# EAGLE design NU-Smarticles_old (EAGLE 9.3.0)

## Sheet 1 of 5
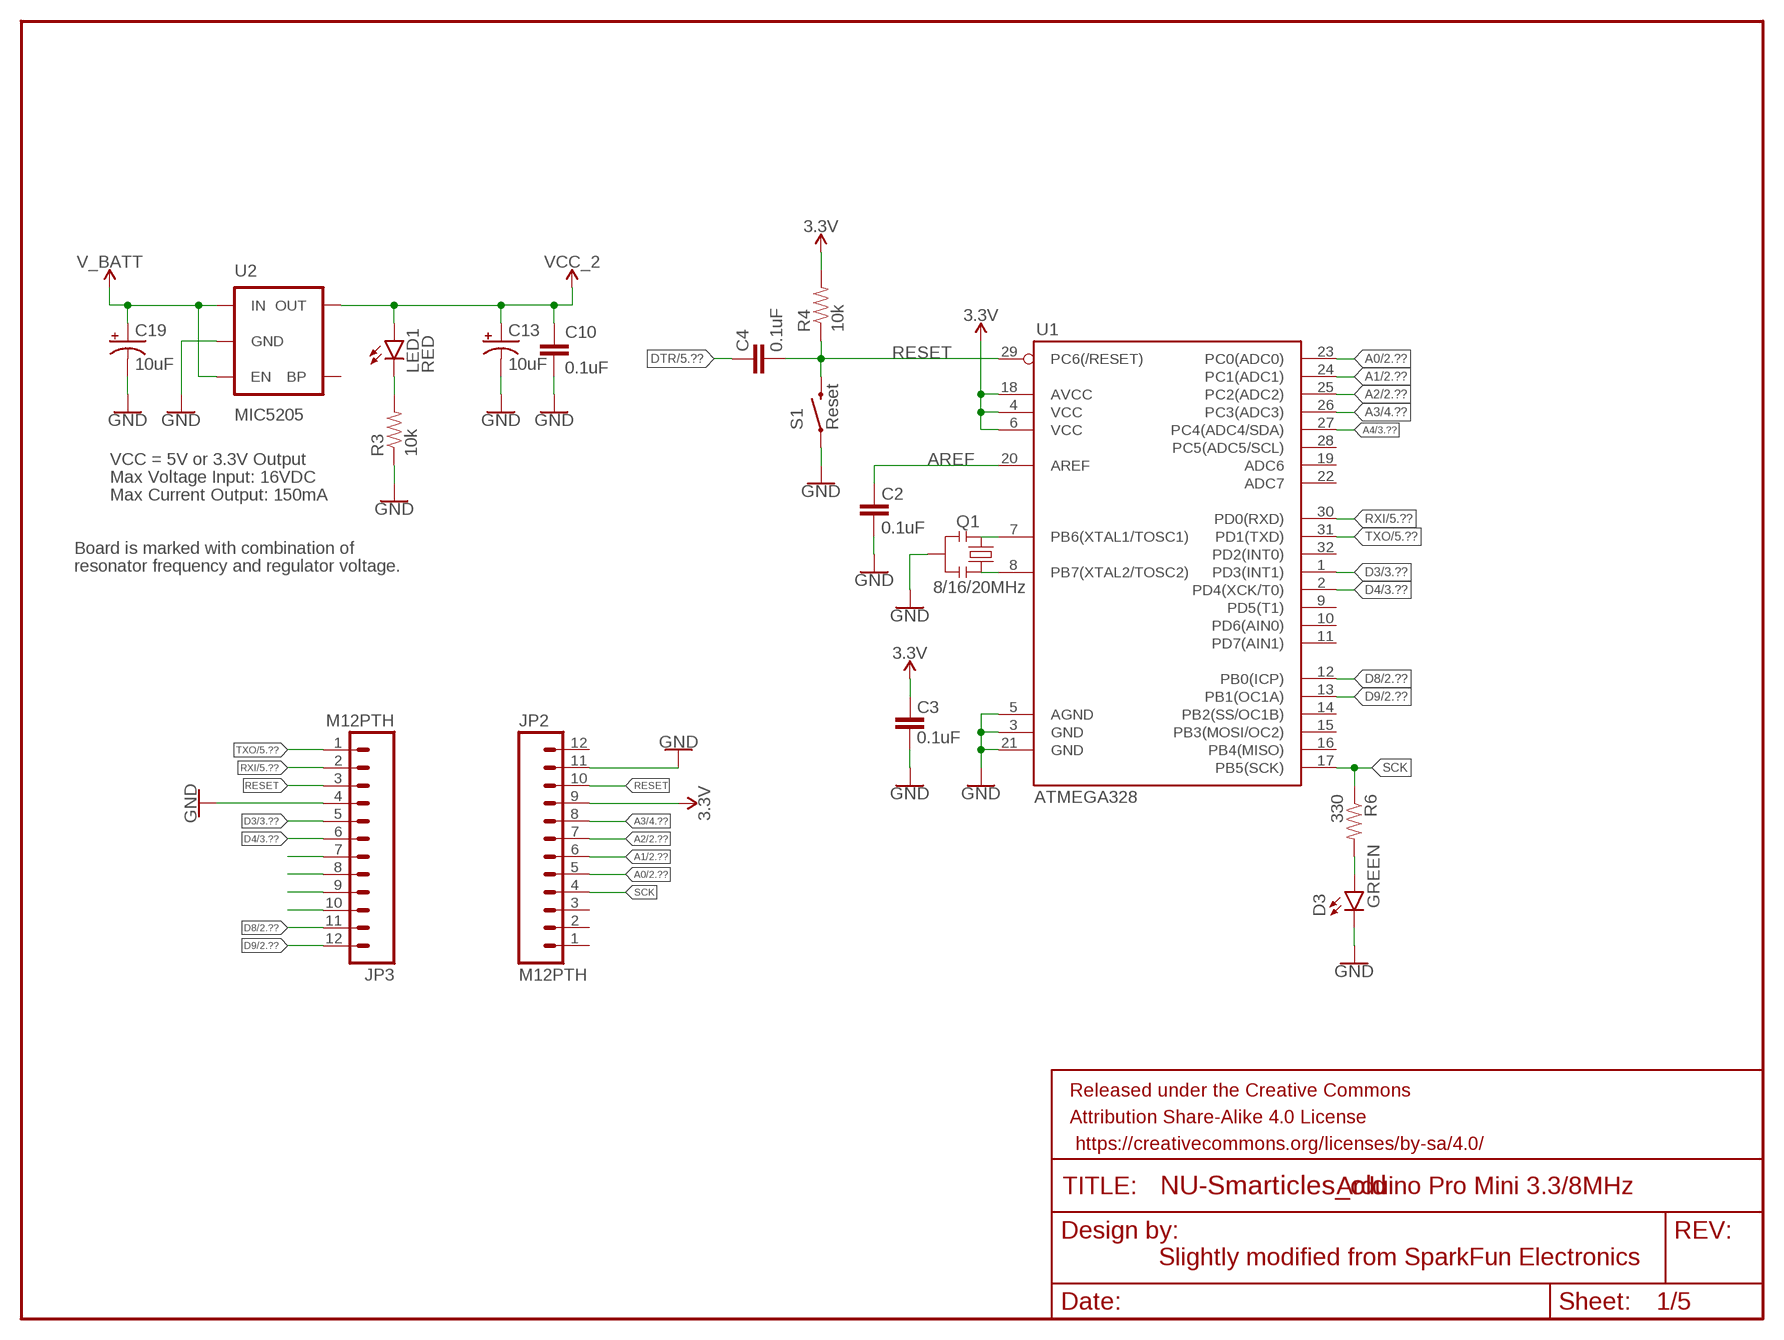
[diagram p0: schematic, sheet 1]

### Parts
C2  0.1uF  0.1UF-0603-25V-(+80/-20%)  [0603]
C3  0.1uF  0.1UF-0603-25V-(+80/-20%)  [0603]
C4  0.1uF  0.1UF-0603-25V-(+80/-20%)  [0603]
C10  0.1uF  0.1UF-0603-25V-(+80/-20%)  [0603]
C13  10uF  10UF-POLAR-0603-6.3V-20%(TANT)  [0603-POLAR]
C19  10uF  10UF-POLAR-0603-6.3V-20%(TANT)  [0603-POLAR]
D3  GREEN  LED-GREEN0603  [LED-0603]
FRAME3  FRAME-LETTER  [CREATIVE_COMMONS]
JP2  M12PTH  [SPARKFUN_1X12]
JP3  M12PTH  [SPARKFUN_1X12]
LED1  RED  LED-RED0603  [LED-0603]
Q1  8/16/20MHz  TESTING_RESONATOR1:1  [TESTING_RESONATOR-SMD-1:1]
R3  10k  10KOHM-0603-1/10W-1%  [0603]
R4  10k  10KOHM-0603-1/10W-1%  [0603]
R6  330  330OHM-0603-1/10W-1%  [0603]
S1  Reset  TESTING_SWITCH-MOMENTARY-2SMD-ALT01  [TESTING_TACTILE-SWITCH-SMD-ALT01]
U1  ATMEGA328  ATMEGA168  [TQFP32-08]
U2  MIC5205  V_REG_LDO  [SOT23-5]

### Nets
3.3V: C3.2 JP2.9 R4.2 U1.4(VCC) U1.6(VCC) U1.18(AVCC) ; also sheet 2,3,4,5
A0: JP2.5 U1.23(PC0(ADC0)) ; also sheet 2
A1: JP2.6 U1.24(PC1(ADC1)) ; also sheet 2
A2: JP2.7 U1.25(PC2(ADC2)) ; also sheet 2
A3: JP2.8 U1.26(PC3(ADC3)) ; also sheet 4
A4: U1.27(PC4(ADC4/SDA)) ; also sheet 3
AREF: C2.2 U1.20(AREF)
D3: JP3.5 U1.1(PD3(INT1)) ; also sheet 3
D4: JP3.6 U1.2(PD4(XCK/T0)) ; also sheet 3
D8: JP3.11 U1.12(PB0(ICP)) ; also sheet 2
D9: JP3.12 U1.13(PB1(OC1A)) ; also sheet 2
DTR: C4.2 ; also sheet 5
GND: C2.1 C3.1 C10.2 C13.- C19.- D3.C JP2.11 JP3.4 Q1.2 R3.1 S1.1 S1.2 U1.3(GND) U1.5(AGND) U1.21(GND) U2.2(GND) ; also sheet 2,3,4,5
N$2: Q1.3 U1.8(PB7(XTAL2/TOSC2))
N$3: Q1.1 U1.7(PB6(XTAL1/TOSC1))
N$6: LED1.C R3.2
N$7: D3.A R6.2
N$36: JP3.7
N$37: JP3.8
N$38: JP3.9
N$39: JP3.10
RESET: C4.1 JP2.10 JP3.3 R4.1 S1.3 S1.4 U1.29(PC6(/RESET))
RXI: JP3.2 U1.30(PD0(RXD)) ; also sheet 5
SCK: JP2.4 R6.1 U1.17(PB5(SCK))
TXO: JP3.1 U1.31(PD1(TXD)) ; also sheet 5
V_BATT: C19.+ U2.1(IN) U2.3(EN) ; also sheet 2,3
VCC_2: C10.1 C13.+ LED1.A U2.5(OUT)
Unconnected: JP2.1 JP2.2 JP2.3 JP2.12 U1.9(PD5(T1)) U1.10(PD6(AIN0)) U1.11(PD7(AIN1)) U1.14(PB2(SS/OC1B)) U1.15(PB3(MOSI/OC2)) U1.16(PB4(MISO)) U1.19(ADC6) U1.22(ADC7) U1.28(PC5(ADC5/SCL)) U1.32(PD2(INT0)) U2.4(BP)

### Notes on the sheet
- VCC = 5V or 3.3V Output
- Max Voltage Input: 16VDC
- Max Current Output: 150mA
- Board is marked with combination of
- resonator frequency and regulator voltage.
- Arduino Pro Mini 3.3/8MHz
- Slightly modified from SparkFun Electronics

## Sheet 2 of 5
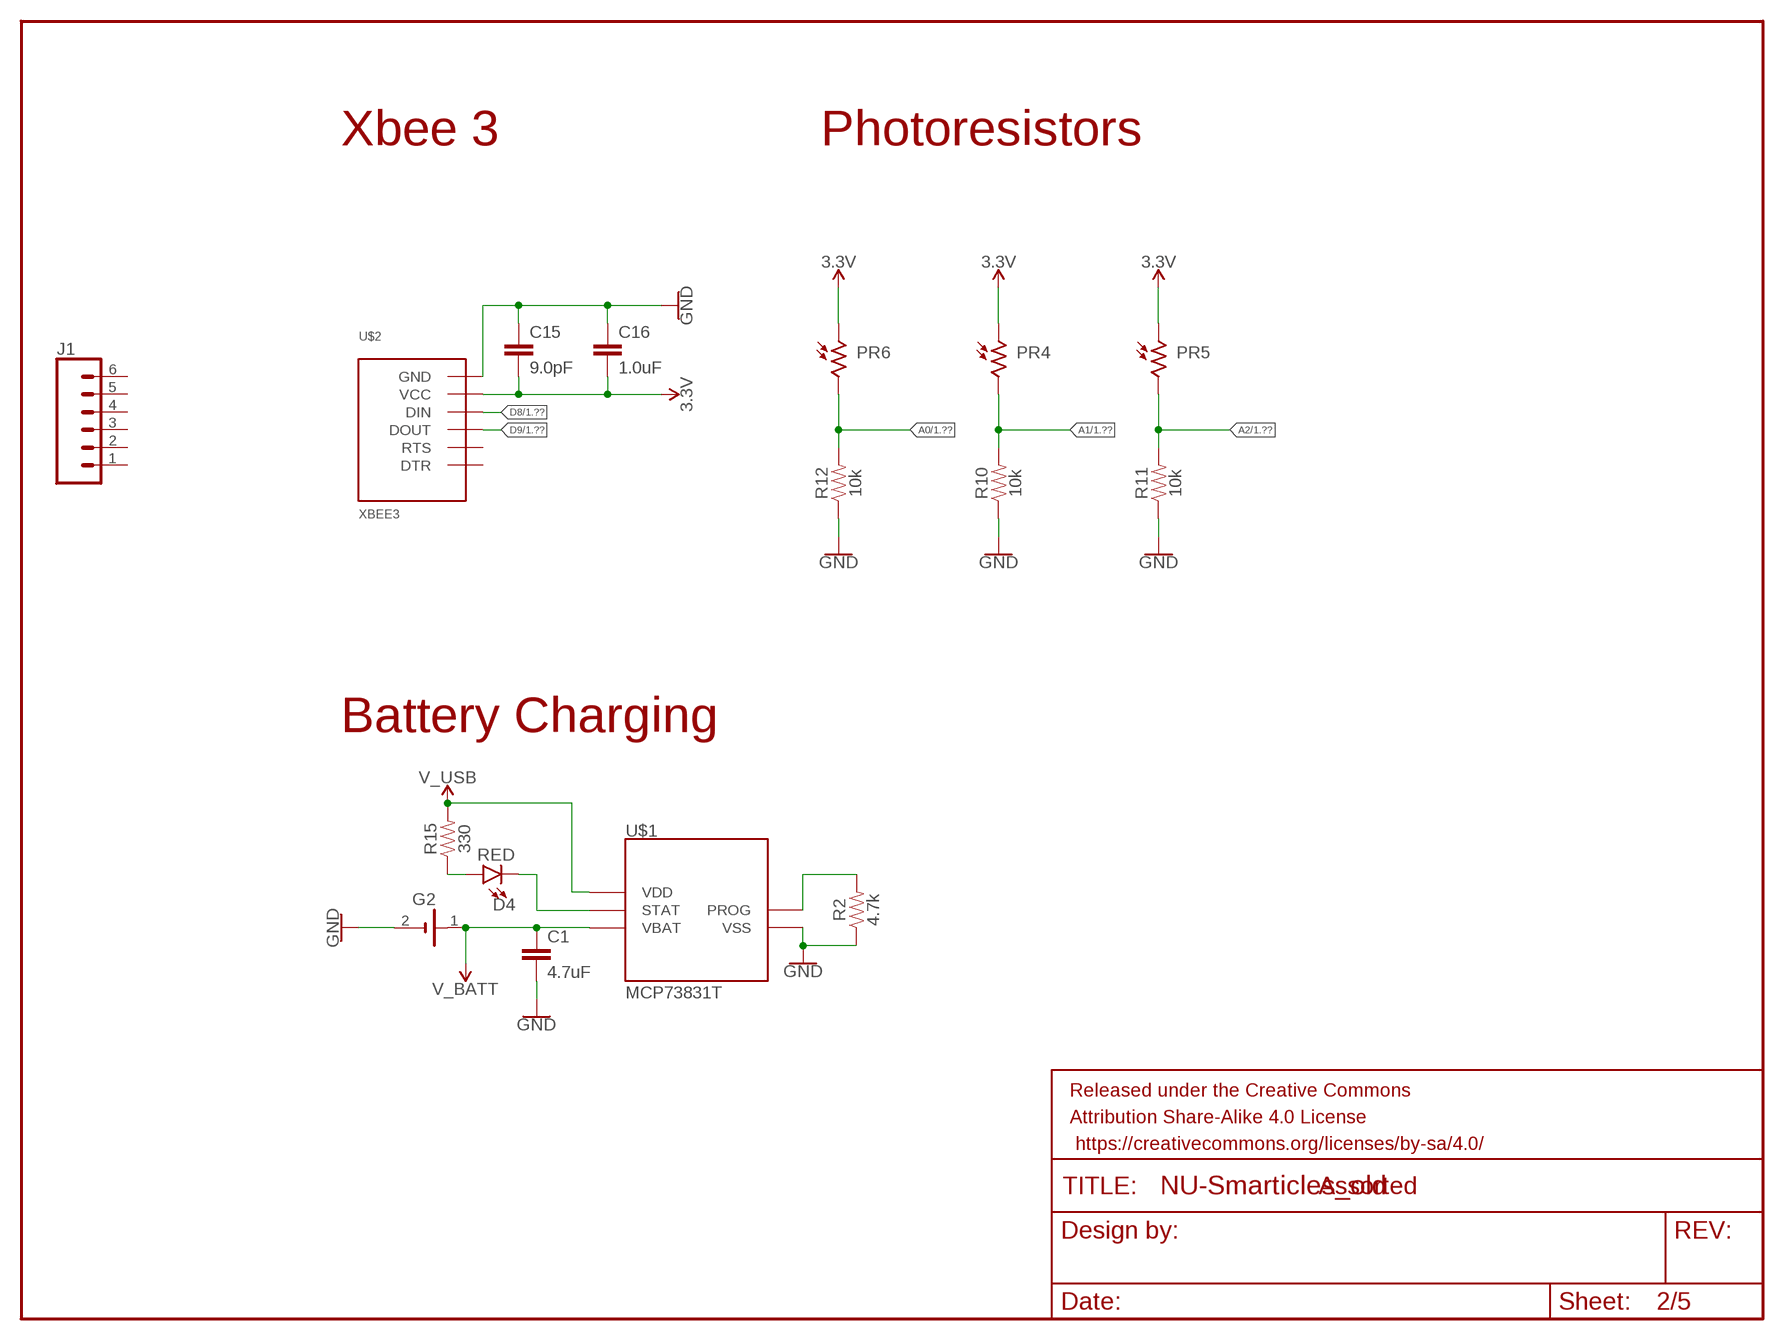
[diagram p1: schematic, sheet 2]

### Parts
C1  4.7uF  4.7UF0603  [0603]
C15  9.0pF  9.0PF-0603-50V-10%  [0603]
C16  1.0uF  1.0UF-0603-16V-10%  [0603]
D4  RED  LED-RED0603  [LED-0603]
FRAME1  FRAME-LETTER  [CREATIVE_COMMONS]
G2  LI-PO  [1X02_BATT]
J1  CONN_06NO_SILK_FEMALE_PTH  [1X06_NO_SILK]
PR4  A1050_09  [T0-46-A10XX]
PR5  A1050_09  [T0-46-A10XX]
PR6  A1050_09  [T0-46-A10XX]
R2  4.7k  4.7KOHM-0603-1/10W-1%  [0603]
R10  10k  10KOHM-0603-1/10W-1%  [0603]
R11  10k  10KOHM-0603-1/10W-1%  [0603]
R12  10k  10KOHM-0603-1/10W-1%  [0603]
R15  330  330OHM-0603-1/10W-1%  [0603]
U$1  MCP73831T  [SOT23-5]
U$2  XBEE3  [XBEE3_MICRO]

### Nets
3.3V: C15.2 C16.2 PR4.1 PR5.1 PR6.1 U$2.VCC ; also sheet 1,3,4,5
A0: PR6.2 R12.2 ; also sheet 1
A1: PR4.2 R10.2 ; also sheet 1
A2: PR5.2 R11.2 ; also sheet 1
D8: U$2.DIN/CONFIG/DIO14(DIN) ; also sheet 1
D9: U$2.DOUT/DIO13(DOUT) ; also sheet 1
GND: C1.2 C15.1 C16.1 G2.2(-) R2.1 R10.1 R11.1 R12.1 U$1.2(VSS) U$2.GND1(GND) ; also sheet 1,3,4,5
N$1: R2.2 U$1.5(PROG)
N$16: D4.A R15.1
N$17: D4.C U$1.1(STAT)
V_BATT: C1.1 G2.1(+) U$1.3(VBAT) ; also sheet 1,3
V_USB: R15.2 U$1.4(VDD) ; also sheet 5
Unconnected: J1.1 J1.2 J1.3 J1.4 J1.5 J1.6 U$2.DTR/SLEEP_RQ/DIO8(DTR) U$2.RTS/DIO6(RTS)

### Notes on the sheet
- Xbee 3 | Photoresistors
- Battery Charging
- Assorted

## Sheet 3 of 5
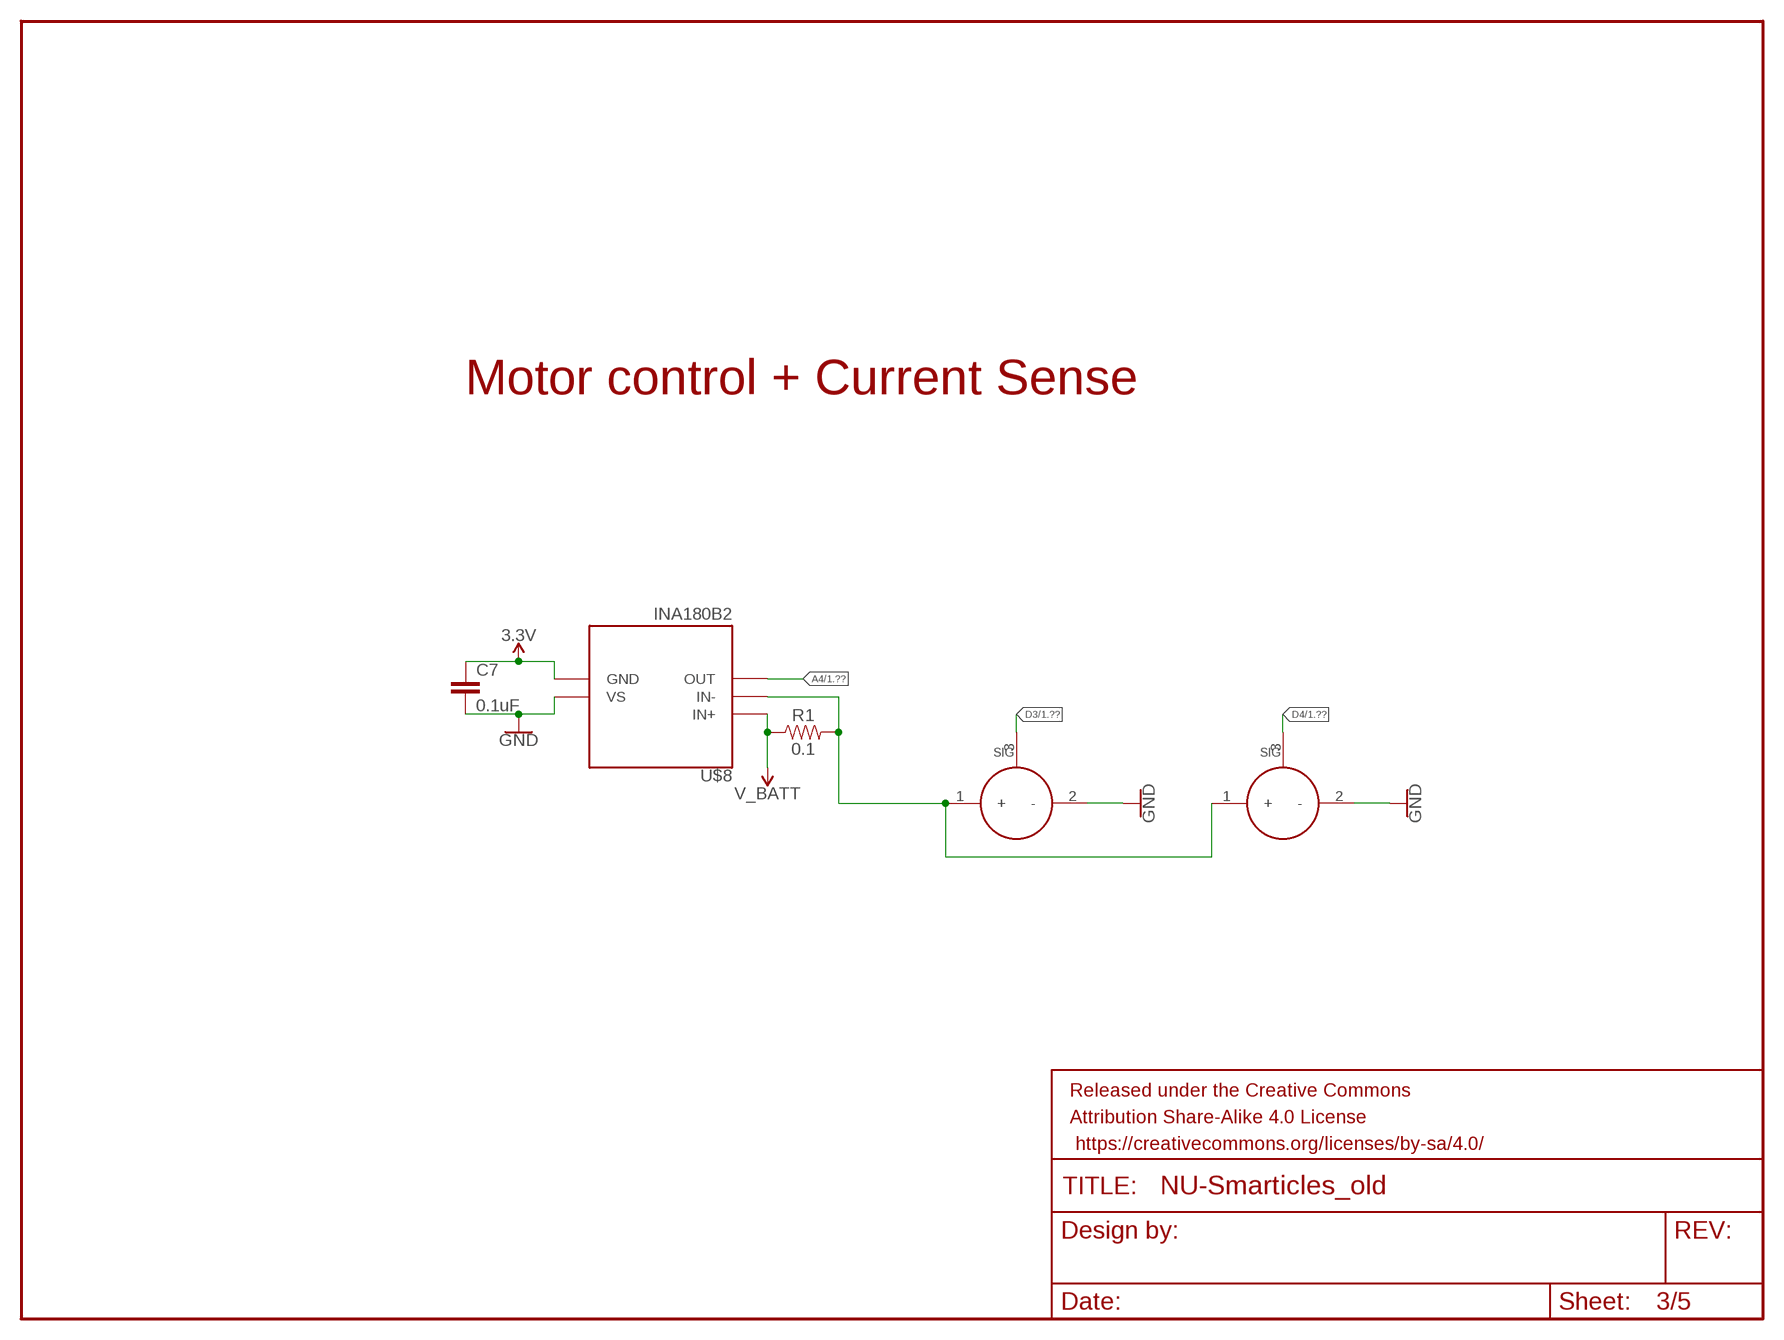
[diagram p2: schematic, sheet 3]

### Parts
C7  0.1uF  0.1UF-0603-25V-5%  [0603]
FRAME2  FRAME-LETTER  [CREATIVE_COMMONS]
R1  0.1  0.1OHM-1210-1/2W-1%  [1210]
U$3  SERVO  [1X03_SERVO]
U$7  SERVO  [1X03_SERVO]
U$8  INA180B2  [SOT23-5]

### Nets
3.3V: C7.1 U$8.2(GND) ; also sheet 1,2,4,5
A4: U$8.4(OUT) ; also sheet 1
D3: U$3.3(SIG) ; also sheet 1
D4: U$7.3(SIG) ; also sheet 1
GND: C7.2 U$3.2(-) U$7.2(-) U$8.5(VS) ; also sheet 1,2,4,5
N$4: R1.2 U$3.1(+) U$7.1(+) U$8.3(IN-)
V_BATT: R1.1 U$8.1(IN+) ; also sheet 1,2

### Notes on the sheet
- Motor control + Current Sense

## Sheet 4 of 5
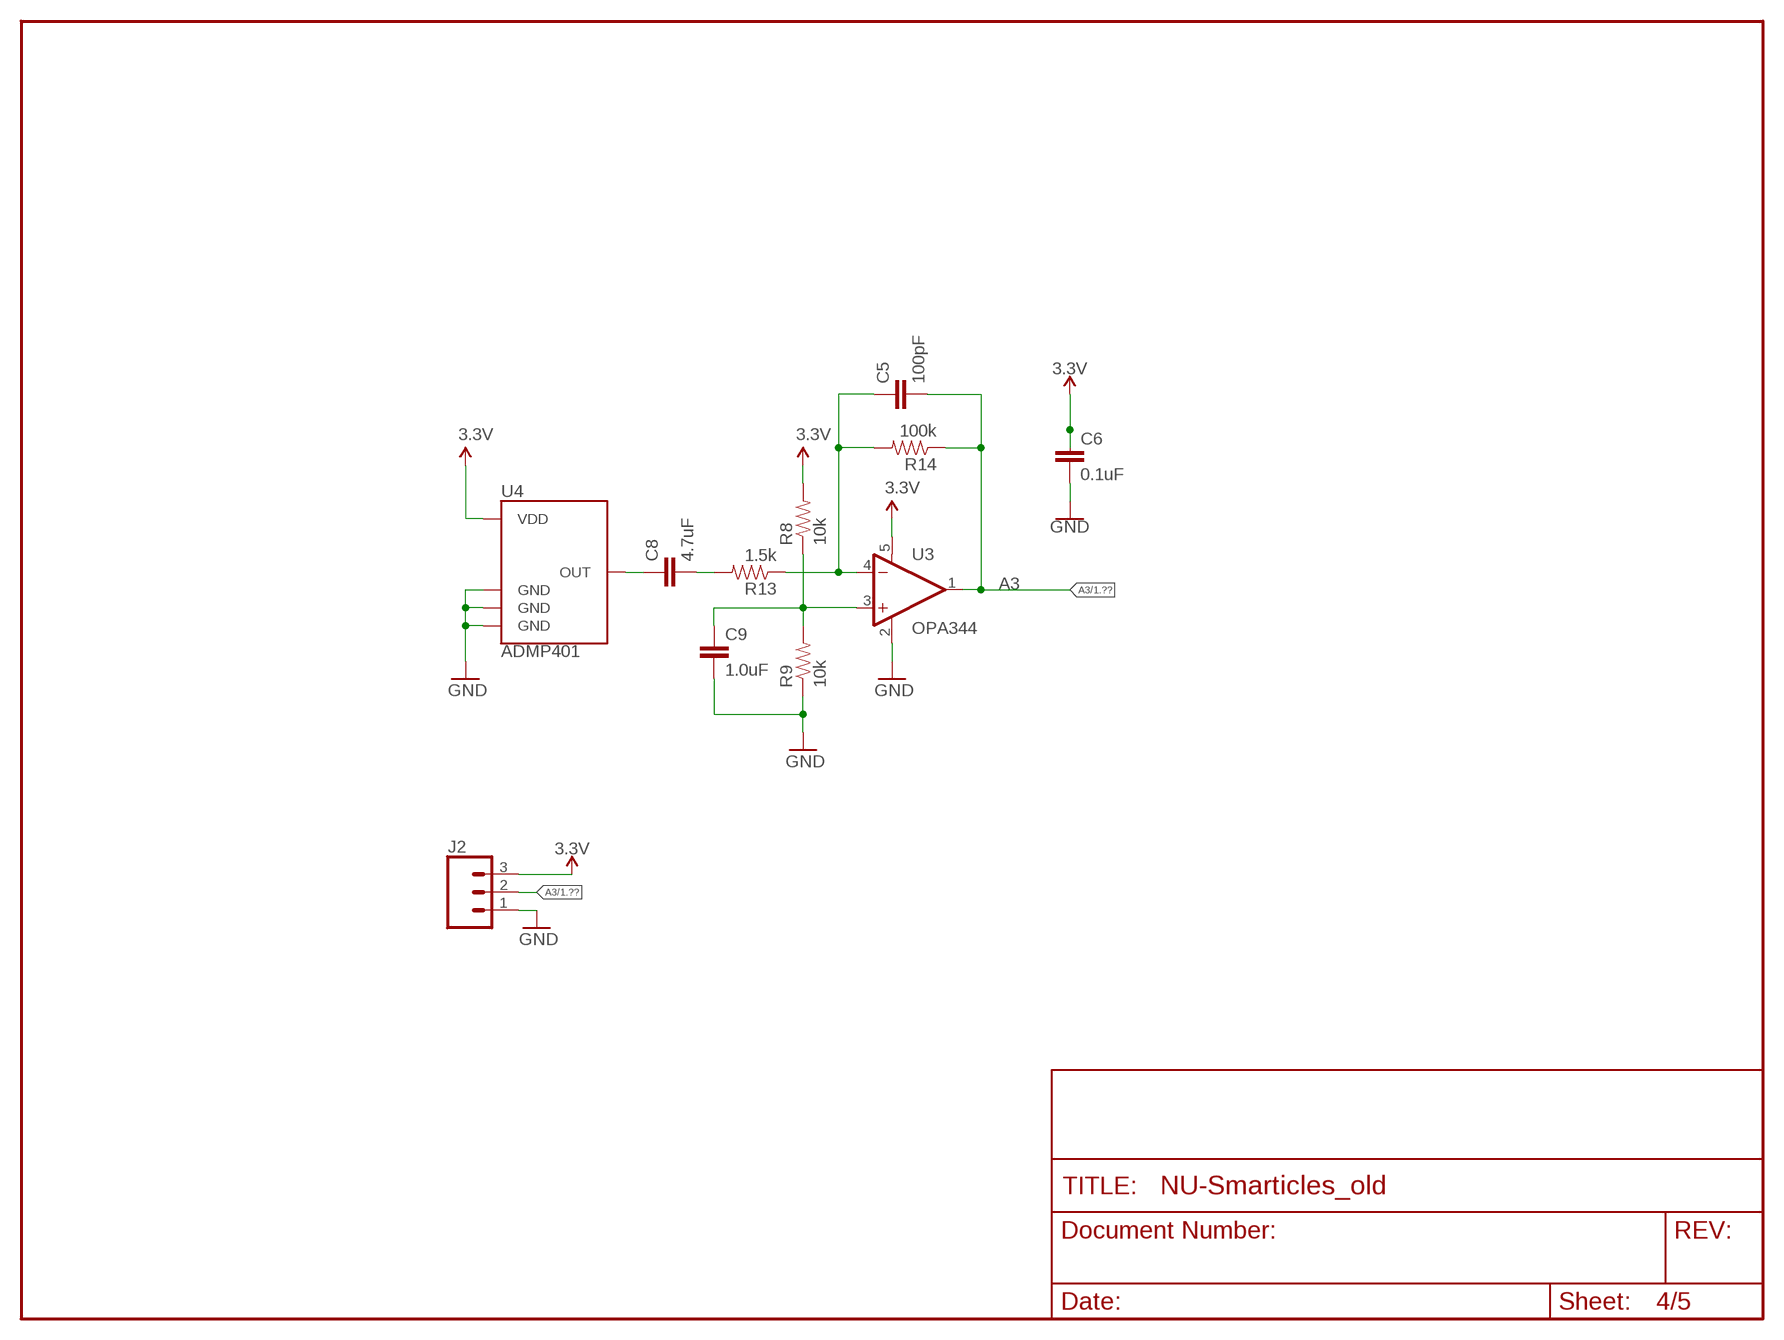
[diagram p3: schematic, sheet 4]

### Parts
C5  100pF  100PF-0603-50V-5%  [0603]
C6  0.1uF  0.1UF-0603-25V-5%  [0603]
C8  4.7uF  4.7UF0603  [0603]
C9  1.0uF  1.0UF-0603-16V-10%  [0603]
J2  CONN_03  [1X03]
R8  10k  10KOHM-0603-1/10W-1%  [0603]
R9  10k  10KOHM-0603-1/10W-1%  [0603]
R13  1.5k  1.5KOHM-0603-1/10W-1%  [0603]
R14  100k  100KOHM-0603-1/10W-1%  [0603]
U3  OPA344  [SOT23-5]
U4  ADMP401  [ADMP401]

### Nets
3.3V: C6.1 J2.3 R8.2 U3.5(V+) U4.5(VDD) ; also sheet 1,2,3,5
A3: C5.2 J2.2 R14.1 U3.1(OUT) ; also sheet 1
GND: C6.2 C9.2 J2.1 R9.1 U3.2(V-) U4.2(GND) U4.4(GND) U4.6(GND) ; also sheet 1,2,3,5
N$8: C8.1 U4.1(OUT)
N$9: C5.1 R13.1 R14.2 U3.4(-IN)
N$10: C8.2 R13.2
N$11: C9.1 R8.1 R9.2 U3.3(+IN)

## Sheet 5 of 5
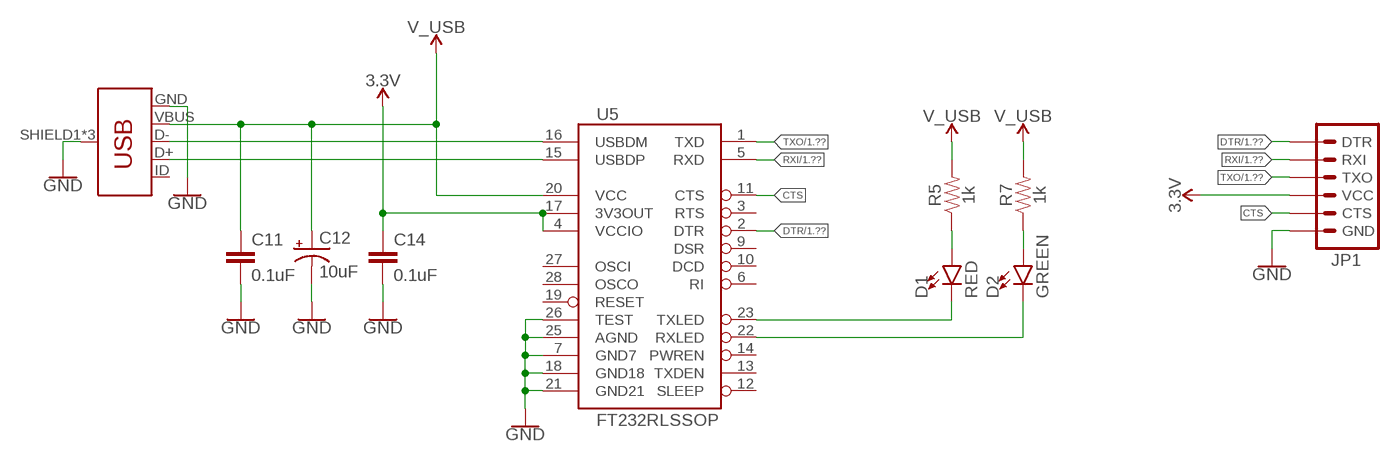
[diagram p4: schematic, sheet 5]

### Parts
C11  0.1uF  0.1UF-0603-25V-(+80/-20%)  [0603]
C12  10uF  10UF-POLAR-0603-6.3V-20%(TANT)  [0603-POLAR]
C14  0.1uF  0.1UF-0603-25V-(+80/-20%)  [0603]
D1  RED  LED-RED0603  [LED-0603]
D2  GREEN  LED-GREEN0603  [LED-0603]
JP1  ARDUINO_SERIAL_PROGRAMPTH  [1X06]
R5  1k  1KOHM-0603-1/10W-1%  [0603]
R7  1k  1KOHM-0603-1/10W-1%  [0603]
U5  FT232RLSSOP  [SSOP28DB]
X2  USB_MICRO-B_FEMALE-SMT  [USB-B-MICRO-SMD]

### Nets
3.3V: C14.1 JP1.4(VCC) U5.4(VCCIO) U5.17(3V3OUT) ; also sheet 1,2,3,4
CTS: JP1.5(CTS) U5.11(CTS)
DTR: JP1.1(DTR) U5.2(DTR) ; also sheet 1
GND: C11.2 C12.- C14.2 JP1.6(GND) U5.7(GND7) U5.18(GND18) U5.21(GND21) U5.25(AGND) U5.26(TEST) X2.GND X2.SHIELD1(SHIELD) X2.SHIELD2(SHIELD) X2.SHIELD3(SHIELD) ; also sheet 1,2,3,4
N$12: D1.A R5.1
N$13: D2.A R7.1
RXI: JP1.2(RXI) U5.5(RXD) ; also sheet 1
RXLED: D2.C U5.22(RXLED)
TXLED: D1.C U5.23(TXLED)
TXO: JP1.3(TXO) U5.1(TXD) ; also sheet 1
USB_D+: U5.15(USBDP) X2.D+
USB_D-: U5.16(USBDM) X2.D-
V_USB: C11.1 C12.+ R5.2 R7.2 U5.20(VCC) X2.VBUS ; also sheet 2
Unconnected: U5.3(RTS) U5.6(RI) U5.9(DSR) U5.10(DCD) U5.12(SLEEP) U5.13(TXDEN) U5.14(PWREN) U5.19(RESET) U5.27(OSCI) U5.28(OSCO)

## Power pins joined to a net without a drawn wire
ID: X2.ID

## Library data of the parts
C1 C8 = SparkFun-Capacitors:4.7UF: 4.7µF ceramic capacitors A capacitor is a passive two-terminal electrical component used to store electrical energy temporarily in an electric field.; PROD_ID: CAP-08280
C2-C4 C10 C11 C14 = SparkFun-Capacitors:0.1UF: 0.1µF ceramic capacitors A capacitor is a passive two-terminal electrical component used to store electrical energy temporarily in an electric field.; PROD_ID: CAP-00810
C5 = SparkFun-Capacitors:100PF: 100pF/0.1nF ceramic capacitors A capacitor is a passive two-terminal electrical component used to store electrical energy temporarily in an electric field.; PROD_ID: CAP-07883
C6 C7 = SparkFun-Capacitors:0.1UF: 0.1µF ceramic capacitors A capacitor is a passive two-terminal electrical component used to store electrical energy temporarily in an electric field.; PROD_ID: CAP-08604
C9 C16 = SparkFun-Capacitors:1.0UF: 1µF ceramic capacitors A capacitor is a passive two-terminal electrical component used to store electrical energy temporarily in an electric field.; PROD_ID: CAP-00868
C12 C13 C19 = SparkFun-Capacitors:10UF-POLAR: 10.0µF polarized capacitors A capacitor is a passive two-terminal electrical component used to store electrical energy temporarily in an electric field.; PROD_ID: CAP-13210
C15 = SparkFun-Capacitors:9.0PF: 9.0pF ceramic capacitors A capacitor is a passive two-terminal electrical component used to store electrical energy temporarily in an electric field.; PROD_ID: CAP-09341
D1 D4 LED1 = SparkFun-LED:LED-RED: Red SMD LED Used in manufacturing of most products at SparkFun Packages: 0603 - SMD 0603 package [Product Link] <http://docs.avagotech.com/docs/AV02-0551EN> 0603 SMART - SMD 0603 SMART package ( more efficient and expensive)[Product Link] <http://www.osram-os.com/Graphics/XPic2/00077099_0.pdf> 1206 - SMD1206 package [Product Link] <https://www.sparkfun.com/datasheets/DevTools/LilyPad/Q150OVS4.pdff> SparkFun Products: Pro Mini 328 -5V <https://www.sparkfun.com/products/821> RedBoard <https://www.sparkfun.com/products/12757> IOIO-OTG <https://www.sparkfun.com/products/13613>; PROD_ID: DIO-00819
D2 D3 = SparkFun-LED:LED-GREEN: Green SMD LED Used in manufacturing of various products at SparkFun Packages: 0603 - SMD 0603 package [Product Link] <http://www.futureelectronics.com/en/technologies/semiconductors/optoelectronics/leds/Pages/9894312-LTST-C190GKT.aspx?CrossPart=HSMG-C190&IM=0> LilyPad 1206 - SMD1206 LilyPad package [Product Link] <http://www.futureelectronics.com/en/Technologies/Product.aspx?ProductID=IN150NGHARVATEKCORPORATION2049943&IM=0> 1206 - SMD1206 package [Product Link] <http://www.futureelectronics.com/en/technologies/semiconductors/optoelectronics/leds/Pages/8315665-LTST-C150KGKT.aspx?IM=0> 1206 Bottom Mount -SMD 1206 Bottom Mount [Product Link] <http://www.digikey.com/product-detail/en/lite-on-inc/LTST-C230KGKT/160-1456-1-ND/386854> SparkFun Products: Pro Mini 328 -5V <https://www.sparkfun.com/products/821> RedBoard <https://www.sparkfun.com/products/12757> MP3 Trigger <https://www.sparkfun.com/products/13720> Makey Makey <https://www.sparkfun.com/products/11076>; PROD_ID: DIO-00821
FRAME1-FRAME3 = SparkFun-Aesthetics:FRAME-LETTER: Schematic Frame - Letter Standard 8.5x11 US Letter frame
G2 = Smarticles:LI-PO
J1 = SparkFun-Connectors:CONN_06: Multi connection point. Often used as Generic Header-pin footprint for 0.1 inch spaced/style header connections On any of the 0.1 inch spaced packages, you can populate with these: Break Away Headers - Straight <https://www.sparkfun.com/products/116> (PRT-00116) Break Away Male Headers - Right Angle <https://www.sparkfun.com/products/553> (PRT-00553) Female Headers <https://www.sparkfun.com/products/115> (PRT-00115) Break Away Headers - Machine Pin <https://www.sparkfun.com/products/117> (PRT-00117) Break Away Female Headers - Swiss Machine Pin <https://www.sparkfun.com/products/743> (PRT-00743) Arduino Stackable Header - 6 Pin <https://www.sparkfun.com/products/9280> (PRT-09280) For SCREWTERMINALS and SPRING TERMINALS visit here: Screw Terimnals on SparkFun.com <https://www.sparkfun.com/search/results?term=Screw+Terminals> (5mm/3.5mm/2.54mm spacing) This device is also useful as a general connection point to wire up your design to another part of your project. Our various solder wires solder well into these plated through hole pads. Hook-Up Wire - Assortment (Stranded, 22 AWG) <https://www.sparkfun.com/products/11375> (PRT-11375) Hook-Up Wire - Assortment (Solid Core, 22 AWG) <https://www.sparkfun.com/products/11367> (PRT-11367) View the entire wire category on our website here <https://www.sparkfun.com/categories/141>; PROD_ID: CONN-08437
J2 = SparkFun-Connectors:CONN_03: Multi connection point. Often used as Generic Header-pin footprint for 0.1 inch spaced/style header connections On any of the 0.1 inch spaced packages, you can populate with these: Break Away Headers - Straight <https://www.sparkfun.com/products/116> (PRT-00116) Break Away Male Headers - Right Angle <https://www.sparkfun.com/products/553> (PRT-00553) Female Headers <https://www.sparkfun.com/products/115> (PRT-00115) Break Away Headers - Machine Pin <https://www.sparkfun.com/products/117> (PRT-00117) Break Away Female Headers - Swiss Machine Pin <https://www.sparkfun.com/products/743> (PRT-00743) Stackable Header - 3 Pin (Female, 0.1") <https://www.sparkfun.com/products/13875> (PRT-13875) For SCREWTERMINALS and SPRING TERMINALS visit here: Screw Terimnals on SparkFun.com <https://www.sparkfun.com/search/results?term=Screw+Terminals> (5mm/3.5mm/2.54mm spacing) This device is also useful as a general connection point to wire up your design to another part of your project. Our various solder wires solder well into these plated through hole pads. Hook-Up Wire - Assortment (Stranded, 22 AWG) <https://www.sparkfun.com/products/11375> (PRT-11375) Hook-Up Wire - Assortment (Solid Core, 22 AWG) <https://www.sparkfun.com/products/11367> (PRT-11367) View the entire wire category on our website here <https://www.sparkfun.com/categories/141> Special notes: Molex polarized connector foot print use with SKU : PRT-08232 with associated crimp pins and housings.
JP1 = NU-Smarticles:ARDUINO_SERIAL_PROGRAM
JP2 JP3 = NU-Smarticles:M12: Header 12 Standard 12-pin 0.1" header. Use with straight break away headers (SKU : PRT-00116), right angle break away headers (PRT-00553), swiss pins (PRT-00743), machine pins (PRT-00117), and female headers (PRT-00115).
PR4-PR6 = photo-elements:A10: Sensor Robust Light Sensing Applications Outdoor Light Sensing Application Source: http://optoelectronics.perkinelmer.com/content/Datasheets/DTS_PhotocellsA1050.pdf
Q1 = NU-Smarticles:TESTING_RESONATOR: Resonator Small SMD resonator. This is the itty bitty 10/20MHz resonators with built in caps. CSTCE10M0G55 and CSTCE20M0V53. Footprint for SMD has been used in SFE production for years, and does work okay. 1:1 is an attempt to get larger fillets on the sides so it will be easier to inspect these solders in our AOI machine. The pads have been minimized to match the actual metal under the resonator. To see this relation, it includes an image import of the bottom side of the component. Imported to scale on layer 200.
R1 = SparkFun-Resistors:0.1OHM: 0.1Ω resistor A resistor is a passive two-terminal electrical component that implements electrical resistance as a circuit element. Resistors act to reduce current flow, and, at the same time, act to lower voltage levels within circuits. - Wikipedia; PROD_ID: RES-12374
R2 = SparkFun-Resistors:4.7KOHM: 4.7kΩ resistor A resistor is a passive two-terminal electrical component that implements electrical resistance as a circuit element. Resistors act to reduce current flow, and, at the same time, act to lower voltage levels within circuits. - Wikipedia; PROD_ID: RES-07857
R3 R4 R8-R12 = SparkFun-Resistors:10KOHM: 10kΩ resistor A resistor is a passive two-terminal electrical component that implements electrical resistance as a circuit element. Resistors act to reduce current flow, and, at the same time, act to lower voltage levels within circuits. - Wikipedia; PROD_ID: RES-00824
R5 R7 = SparkFun-Resistors:1KOHM: 1kΩ resistor A resistor is a passive two-terminal electrical component that implements electrical resistance as a circuit element. Resistors act to reduce current flow, and, at the same time, act to lower voltage levels within circuits. - Wikipedia; PROD_ID: RES-07856
R6 R15 = SparkFun-Resistors:330OHM: 330Ω resistor A resistor is a passive two-terminal electrical component that implements electrical resistance as a circuit element. Resistors act to reduce current flow, and, at the same time, act to lower voltage levels within circuits. - Wikipedia; PROD_ID: RES-00818
R13 = SparkFun-Resistors:1.5KOHM: 1.5kΩ resistor A resistor is a passive two-terminal electrical component that implements electrical resistance as a circuit element. Resistors act to reduce current flow, and, at the same time, act to lower voltage levels within circuits. - Wikipedia; PROD_ID: RES-08306
R14 = SparkFun-Resistors:100KOHM: 100kΩ resistor A resistor is a passive two-terminal electrical component that implements electrical resistance as a circuit element. Resistors act to reduce current flow, and, at the same time, act to lower voltage levels within circuits. - Wikipedia; PROD_ID: RES-07828
S1 = NU-Smarticles:TESTING_SWITCH-MOMENTARY-2: Various NO switches- pushbuttons, reed, etc; PROD_ID: SWCH-08247
U1 = NU-Smarticles:ATMEGA168: 8MHz MCU
U2 = NU-Smarticles:V_REG_LDO: Voltage Regulator LDO Standard 150mA LDO voltage regulator in SOT-23 layout. Micrel part MIC5205. BP (by-pass) pin is used to lower output noise with 470pF cap.
U3 = NU-Smarticles:OPA344
U4 = NU-Smarticles:ADMP401: MEMS Microphone
U5 = NU-Smarticles:FT232RL: USB UART FT232RL 4th Generation USB UART (USB <-> Serial) Controller. Spark Fun Electronics SKU : COM-00650
U$1 = NU-Smarticles:MCP73831T: LiPo Battery Charger
U$2 = NU-Smarticles:XBEE3: XBee 3 802.15
U$3 U$7 = NU-Smarticles:SERVO
U$8 = NU-Smarticles:INA180B2: 50x gain current sense amplifier
X2 = NU-Smarticles:USB_MICRO-B: USB Type Micro-B Connector Male/female and PTH/SMT variants SparkFun Products: SparkFun microB USB Breakout <https://www.sparkfun.com/products/12035> SparkFun USB microB Plug Breakout <https://www.sparkfun.com/products/10031> SparkFun ESP8266 Thing <https://www.sparkfun.com/products/13231>; PROD_ID: CONN-11752

## Net classes
1 vcc: width 0.254 mm

## Board
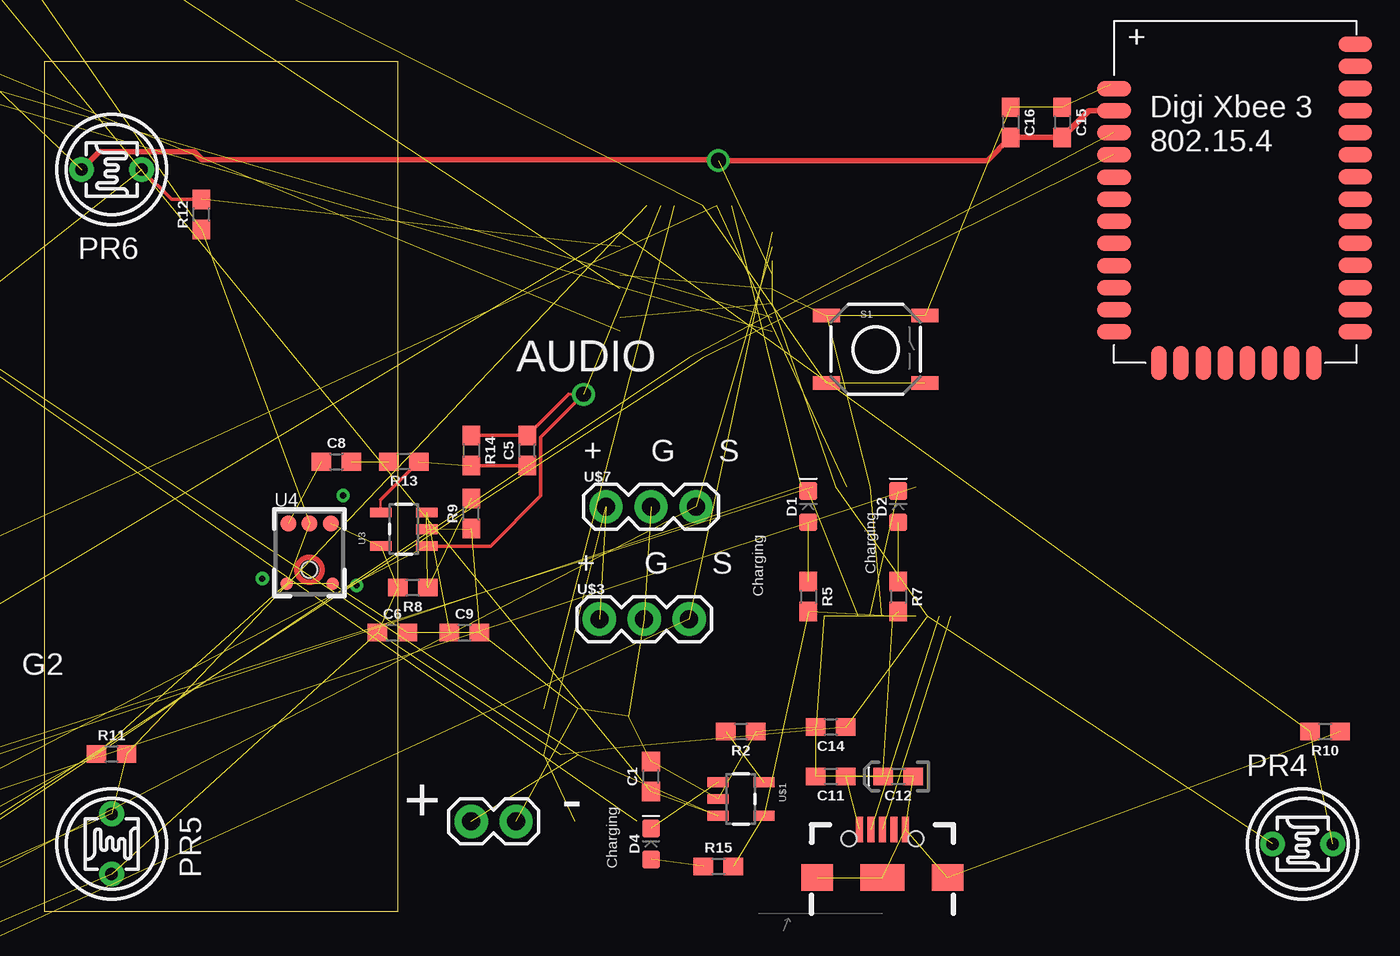
[diagram p5: board, top side]
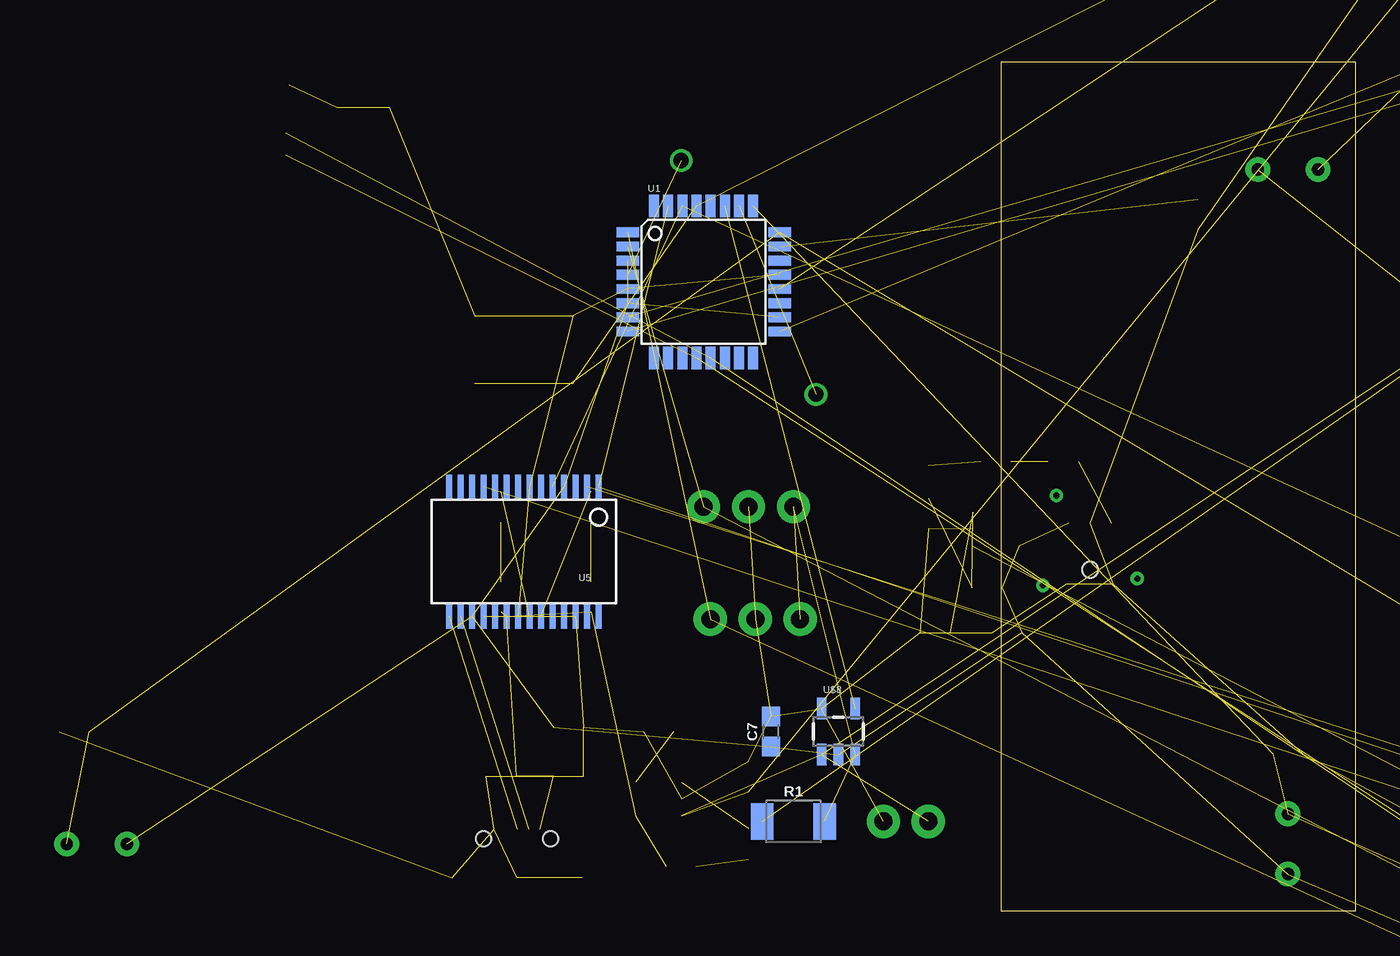
[diagram p6: board, bottom side, seen from below]

Size 20 x 48 mm. Coordinates in mm from the lower left corner, seen from the top.
Outline: 0,0 20,0 20,48 0,48 0,0
Copper layers (1+2*15+16): Top 0.035mm / dielectric 1.5mm / Route2 0.035mm / dielectric 0.15mm / Route15 0.035mm / dielectric 0.2mm / Bottom 0.035mm
Design rules "default *": minimum track width 6mil, minimum drill 0.35mm, track to track 6mil, track to pad 6mil, pad to pad 6mil, via to via 6mil, smd to smd 6mil, copper to edge 40mil, drill to drill 6mil, minimum pad ring 10mil, minimum via ring 8mil, stop-mask expansion 4mil, vias tented up to drill 0mil, thermal gap 10mil

### Footprints (pad centres in the part's own frame; a part is rotated, then mirrored left to right if it is on the bottom)
0603 = smd 1.1 x 1: 1 -0.85,0; 2 0.85,0
0603-POLAR = smd 1.1 x 1: + 0.85,0; - -0.85,0
LED-0603 = smd 1 x 1: A -0.877,0; C 0.877,0
1X02_BATT = drill 1.016 pad 1.88: 1 0,0; 2 2.54,0
1X06_NO_SILK = drill 1.016 pad 1.88: 1 0,0; 2 2.54,0; 3 5.08,0; 4 7.62,0; 5 10.16,0; 6 12.7,0
1X03 = drill 1.016 pad 1.88: 1 0,0; 2 2.54,0; 3 5.08,0
1X06 = drill 1.016 pad 1.88: 1 0,0; 2 2.54,0; 3 5.08,0; 4 7.62,0; 5 10.16,0; 6 12.7,0
SPARKFUN_1X12 = drill 1.016 pad 1.88: 1 0,0; 2 2.54,0; 3 5.08,0; 4 7.62,0; 5 10.16,0; 6 12.7,0; 7 15.24,0; 8 17.78,0; 9 20.32,0; 10 22.86,0; 11 25.4,0; 12 27.94,0
T0-46-A10XX = drill 0.7 pad 1.4: 1 -1.7,0; 2 1.7,0
TESTING_RESONATOR-SMD-1:1 = smd 0.45 x 1.905: 1 -1.2,0; 2 0,0; 3 1.2,0
1210 = smd 1.27 x 2.06: 1 -1.755,0; 2 1.755,0
TESTING_TACTILE-SWITCH-SMD-ALT01 = smd 1.524 x 0.762: 1 -2.794,1.905; 2 2.794,1.905; 3 -2.794,-1.905; 4 2.794,-1.905
TQFP32-08 = smd 1.27 x 0.559: 1 -4.293,2.8; 2 -4.293,2; 3 -4.293,1.2; 4 -4.293,0.4; 5 -4.293,-0.4; 6 -4.293,-1.2; 7 -4.293,-2; 8 -4.293,-2.8; 17 4.293,-2.8; 18 4.293,-2; 19 4.293,-1.2; 20 4.293,-0.4; 21 4.293,0.4; 22 4.293,1.2; 23 4.293,2; 24 4.293,2.8 | smd 0.559 x 1.27: 9 -2.8,-4.293; 10 -2,-4.293; 11 -1.2,-4.293; 12 -0.4,-4.293; 13 0.4,-4.293; 14 1.2,-4.293; 15 2,-4.293; 16 2.8,-4.293; 25 2.8,4.293; 26 2,4.293; 27 1.2,4.293; 28 0.4,4.293; 29 -0.4,4.293; 30 -1.2,4.293; 31 -2,4.293; 32 -2.8,4.293
SOT23-5 = smd 0.55 x 1.2: 1 -0.95,-1.3; 2 0,-1.3; 3 0.95,-1.3; 4 0.95,1.3; 5 -0.95,1.3
ADMP401 = smd 0.9 x 0.9: 1 -1.2,2.62; 5 1.2,2.62; 6 0,2.62 | smd 0.7 x 0.7: 2 1.3,-0.8; 4 -1.3,-0.8 | hole 0.9: 0,0
SSOP28DB = smd 0.348 x 1.397: 1 -4.225,-3.656; 2 -3.575,-3.656; 3 -2.925,-3.656; 4 -2.275,-3.656; 5 -1.625,-3.656; 6 -0.975,-3.656; 7 -0.325,-3.656; 8 0.325,-3.656; 9 0.975,-3.656; 10 1.625,-3.656; 11 2.275,-3.656; 12 2.925,-3.656; 13 3.575,-3.656; 14 4.225,-3.656; 15 4.225,3.656; 16 3.575,3.656; 17 2.925,3.656; 18 2.275,3.656; 19 1.625,3.656; 20 0.975,3.656; 21 0.325,3.656; 22 -0.325,3.656; 23 -0.975,3.656; 24 -1.625,3.656; 25 -2.275,3.656; 26 -2.925,3.656; 27 -3.575,3.656; 28 -4.225,3.656
XBEE3_MICRO = smd 0.864 x 1.905: [RESERVED1] 0.681,-9.652; [RESERVED2] 1.93,-9.652; [RESERVED3] 3.18,-9.652; [RESERVED4] 4.43,-9.652; SPI_CLK/DIO18 -4.318,-9.652; SPI_MOSI/DIO15 -0.569,-9.652; SPI_MOSI/DIO16 -1.819,-9.652; SPI_SSEL/DIO17 -3.068,-9.652 | smd 1.905 x 0.864: [RESERVED5] 6.782,-6.65; AD0/DIO0 6.782,4.597; AD1/DIO1 6.782,3.348; AD2/DIO2 6.782,2.098; AD3/DIO3 6.782,0.848; ASSOCIATE/DIO5 6.782,-1.651; CTS/DIO7 6.782,-4.15; DIN/CONFIG/DIO14 -6.858,2.093; DIO4 6.782,-5.4; DIO12 -6.858,0.843; DOUT/DIO13 -6.858,3.343; DTR/SLEEP_RQ/DIO8 -6.858,-4.155; GND1 -6.858,5.842; GND2 -6.858,-5.405; GND3 -6.858,-7.904; GND4 6.782,-7.899; GND5 6.782,5.847; GND6 6.782,8.346; ON/SLEEP/DIO9 6.782,-2.901; PWM1/DIO11 -6.858,-2.906; RF 6.782,7.097; RSSI_PWM/DIO10 -6.858,-1.656; RST -6.858,-0.406; RTS/DIO6 6.782,-0.401; SPI_ATTN/BOOTMODE/DIO19 -6.858,-6.655; VCC -6.858,4.592
1X03_SERVO = drill 1.016 pad 1.88: 1 0,0; 2 2.54,0; 3 5.08,0
USB-B-MICRO-SMD = smd 1.45 x 0.4: D+ 2.725,0; D- 2.725,0.65; GND 2.725,-1.3; ID 2.725,-0.65; VBUS 2.725,1.3 | smd 1.5 x 1.8: SHIELD1 0,3.685; SHIELD2 0,-3.685 | smd 1.5 x 2.5: SHIELD3 0,0 | hole 0.85: 2.2,1.9; 2.2,-1.9

### Placement (x,y rotation side)
C1  34.29,7.62 90 top  (outside the outline)
C2  -30.48,77.47 0 bottom  (outside the outline)
C3  -34.29,77.47 0 bottom  (outside the outline)
C4  -38.1,77.47 0 bottom  (outside the outline)
C5  27.3,26.04 90 top  (outside the outline)
C6  19.68,15.75 0 top
C7  33.02,10.16 90 bottom  (outside the outline)
C8  16.51,25.4 0 top
C9  23.75,15.75 0 top
C10  -60.96,77.47 0 bottom  (outside the outline)
C11  44.45,7.62 180 top  (outside the outline)
C12  48.26,7.62 180 top  (outside the outline)
C13  -19.05,77.47 0 bottom  (outside the outline)
C14  44.45,10.41 180 top  (outside the outline)
C15  57.53,44.58 270 top  (outside the outline)
C16  54.61,44.58 270 top  (outside the outline)
C19  -22.86,77.47 0 bottom  (outside the outline)
D1  43.18,22.86 90 top  (outside the outline)
D2  48.26,22.86 90 top  (outside the outline)
D3  -34.29,82.55 0 top  (outside the outline)
D4  34.29,3.81 90 top  (outside the outline)
FRAME1  -82.55,-13.97 0 top  (outside the outline)
FRAME2  -80.01,50.8 0 top  (outside the outline)
FRAME3  -80.01,59.69 0 top  (outside the outline)
G2  24.13,5.08 0 top  (outside the outline)
J1  -101,-48 0 top  (outside the outline)
J2  -101,-52 0 top  (outside the outline)
JP1  -95.25,-20.32 0 top  (outside the outline)
JP2  -101,-34 0 top  (outside the outline)
JP3  -101,-42 0 top  (outside the outline)
LED1  -38.1,82.55 0 top  (outside the outline)
PR4  71.12,3.81 0 top  (outside the outline)
PR5  3.81,3.81 90 top
PR6  3.81,41.91 0 top
Q1  -83.82,69.85 0 bottom  (outside the outline)
R1  31.75,5.08 0 bottom  (outside the outline)
R2  39.37,10.16 180 top  (outside the outline)
R3  -68.58,77.47 0 bottom  (outside the outline)
R4  -72.39,77.47 0 bottom  (outside the outline)
R5  43.18,17.78 270 top  (outside the outline)
R6  -76.2,77.47 0 bottom  (outside the outline)
R7  48.26,17.78 270 top  (outside the outline)
R8  20.83,18.29 180 top
R9  24.13,22.48 90 top  (outside the outline)
R10  72.39,10.16 180 top  (outside the outline)
R11  3.81,8.89 0 top
R12  8.89,39.37 90 top
R13  20.32,25.4 180 top
R14  24.13,26.04 270 top  (outside the outline)
R15  38.1,2.54 0 top  (outside the outline)
S1  46.99,31.75 0 top  (outside the outline)
U1  36.83,35.56 0 bottom  (outside the outline)
U2  -58.42,69.85 0 bottom  (outside the outline)
U3  20.32,21.59 90 top
U4  14.99,19.3 0 top
U5  46.99,20.32 180 bottom  (outside the outline)
U$1  39.37,6.35 270 top  (outside the outline)
U$2  67.31,40.64 0 top  (outside the outline)
U$3  31.37,16.51 0 top  (outside the outline)
U$7  31.75,22.86 0 top  (outside the outline)
U$8  29.21,10.16 0 bottom  (outside the outline)
X2  47.37,1.91 90 top  (outside the outline)

### Tracks (layer width: path | path; a pad name or v marks a point on that pad's centre or on a via)
3.3V  (via drill 0.85)  (19 unrouted)
  Top 0.305: PR6.1 3.12,42.91 8.47,42.91 8.92,42.46 38.06,42.46 v38.1,42.42 53.3,42.42 C16.2 C15.2 59.04,45.23 U$2.VCC
A0  (2 unrouted)
  Top 0.203: PR6.2 7.2,40.22 R12.2
A1  (3 unrouted)
A2  (3 unrouted)
A3  (via drill 0.85)  (3 unrouted)
  Top 0.152: 29.63,29.21 v30.48,29.21
  Top 0.203: R14.1 C5.2 29.63,29.21 | v30.48,29.21 28.06,26.79 28.06,23.49 25.21,20.64 U3.1
A4  (1 unrouted)
AREF  (1 unrouted)
CTS  (1 unrouted)
D3  (2 unrouted)
D4  (2 unrouted)
D8  (2 unrouted)
D9  (2 unrouted)
DTR  (2 unrouted)
GND  (50 unrouted)
  Top 0.305: 60.24,46.7 U$2.GND1
N$1  (1 unrouted)
N$2  (1 unrouted)
N$3  (1 unrouted)
N$4  (3 unrouted)
N$5  (via drill 0.35)
  other vias: 16.89,23.5
N$6  (1 unrouted)
N$7  (1 unrouted)
N$8  (1 unrouted)
N$9  (1 unrouted)
  Top 0.152: 19.02,23.25 U3.4
  Top 0.203: R13.1 19.02,23.25 | R14.2 C5.1
N$10  (1 unrouted)
N$11  (3 unrouted)
N$12  (1 unrouted)
N$13  (1 unrouted)
N$14  (via drill 0.35)
  other vias: 12.32,18.8
N$15  (via drill 0.35)
  other vias: 17.65,18.41
N$16  (1 unrouted)
N$17  (1 unrouted)
RESET  (6 unrouted)
RXI  (3 unrouted)
RXLED  (1 unrouted)
SCK  (2 unrouted)
TXLED  (1 unrouted)
TXO  (3 unrouted)
USB_D+  (1 unrouted)
USB_D-  (1 unrouted)
V_BATT  (7 unrouted)
V_USB  (7 unrouted)
VCC_2  (3 unrouted)

### Text on the board
tPlace: AUDIO | Charging | Charging | Charging